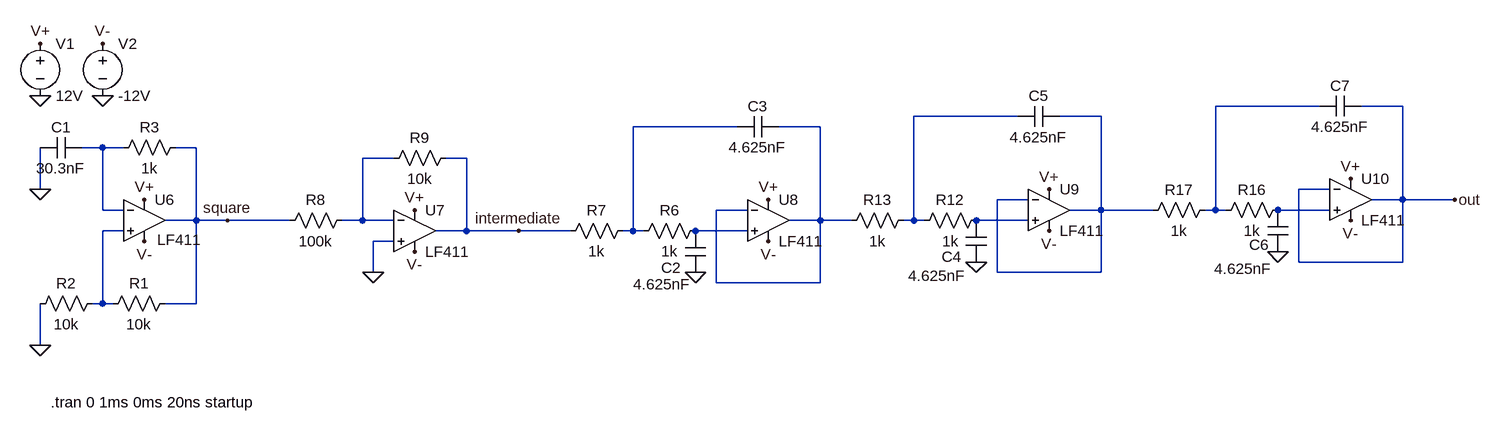
[diagram p0: schematic oscillator.asc]
oscillator.asc, the LTspice schematic file:
Version 4
SHEET 1 1064 680
WIRE 368 -448 208 -448
WIRE 496 -448 432 -448
WIRE -96 -432 -256 -432
WIRE 32 -432 -32 -432
WIRE -528 -416 -688 -416
WIRE -400 -416 -464 -416
WIRE -1504 -384 -1536 -384
WIRE -1472 -384 -1504 -384
WIRE -1360 -384 -1392 -384
WIRE -1056 -368 -1104 -368
WIRE -944 -368 -976 -368
WIRE -1600 -320 -1600 -384
WIRE 384 -320 336 -320
WIRE -80 -304 -128 -304
WIRE 496 -304 496 -448
WIRE 496 -304 448 -304
WIRE 576 -304 496 -304
WIRE -1504 -288 -1504 -384
WIRE -1472 -288 -1504 -288
WIRE -512 -288 -560 -288
WIRE 32 -288 32 -432
WIRE 32 -288 -16 -288
WIRE 112 -288 32 -288
WIRE 208 -288 208 -448
WIRE 208 -288 192 -288
WIRE 224 -288 208 -288
WIRE 384 -288 304 -288
WIRE -1360 -272 -1360 -384
WIRE -1360 -272 -1408 -272
WIRE -1312 -272 -1360 -272
WIRE -1216 -272 -1312 -272
WIRE -1104 -272 -1104 -368
WIRE -1104 -272 -1136 -272
WIRE -1056 -272 -1104 -272
WIRE -400 -272 -400 -416
WIRE -400 -272 -448 -272
WIRE -352 -272 -400 -272
WIRE -256 -272 -256 -432
WIRE -256 -272 -272 -272
WIRE -240 -272 -256 -272
WIRE -80 -272 -160 -272
WIRE -1472 -256 -1504 -256
WIRE -944 -256 -944 -368
WIRE -944 -256 -992 -256
WIRE -864 -256 -944 -256
WIRE -784 -256 -864 -256
WIRE -688 -256 -688 -416
WIRE -688 -256 -704 -256
WIRE -672 -256 -688 -256
WIRE -512 -256 -592 -256
WIRE -1056 -240 -1088 -240
WIRE 336 -208 336 -320
WIRE 496 -208 496 -304
WIRE 496 -208 336 -208
WIRE -1088 -192 -1088 -240
WIRE -128 -192 -128 -304
WIRE 32 -192 32 -288
WIRE 32 -192 -128 -192
WIRE -560 -176 -560 -288
WIRE -400 -176 -400 -272
WIRE -400 -176 -560 -176
WIRE -1504 -144 -1504 -256
WIRE -1504 -144 -1520 -144
WIRE -1488 -144 -1504 -144
WIRE -1360 -144 -1360 -272
WIRE -1360 -144 -1408 -144
WIRE -1600 -80 -1600 -144
FLAG -1600 -464 0
FLAG -1504 -464 0
FLAG -1600 -544 V+
FLAG -1504 -544 V-
FLAG -1440 -304 V+
FLAG -1440 -240 V-
FLAG -1600 -320 0
FLAG -1600 -80 0
FLAG -1312 -272 square
FLAG -480 -304 V+
FLAG -480 -240 V-
FLAG -592 -192 0
FLAG -1024 -288 V+
FLAG -1024 -224 V-
FLAG -1088 -192 0
FLAG -864 -256 intermediate
FLAG -48 -320 V+
FLAG -48 -256 V-
FLAG -160 -208 0
FLAG 416 -336 V+
FLAG 416 -272 V-
FLAG 304 -224 0
FLAG 576 -304 out
SYMBOL voltage -1600 -560 R0
WINDOW 123 0 0 Left 0
WINDOW 39 0 0 Left 0
SYMATTR InstName V1
SYMATTR Value 12V
SYMBOL voltage -1504 -560 R0
WINDOW 123 0 0 Left 0
WINDOW 39 0 0 Left 0
SYMATTR InstName V2
SYMATTR Value -12V
SYMBOL res -1392 -160 R90
WINDOW 0 0 56 VBottom 0
WINDOW 3 32 56 VTop 0
SYMATTR InstName R1
SYMATTR Value 10k
SYMBOL res -1504 -160 R90
WINDOW 0 0 56 VBottom 0
WINDOW 3 32 56 VTop 0
SYMATTR InstName R2
SYMATTR Value 10k
SYMBOL res -1376 -400 R90
WINDOW 0 0 56 VBottom 0
WINDOW 3 32 56 VTop 0
SYMATTR InstName R3
SYMATTR Value 1k
SYMBOL cap -1536 -400 R90
WINDOW 0 0 32 VBottom 0
WINDOW 3 32 32 VTop 0
SYMATTR InstName C1
SYMATTR Value 30.3nF
SYMBOL cap -608 -256 R0
WINDOW 0 -37 57 Left 0
WINDOW 3 -80 82 Left 0
SYMATTR InstName C2
SYMATTR Value 4.625nF
SYMBOL res -576 -272 R90
WINDOW 0 0 56 VBottom 0
WINDOW 3 32 56 VTop 0
SYMATTR InstName R6
SYMATTR Value 1k
SYMBOL res -688 -272 R90
WINDOW 0 0 56 VBottom 0
WINDOW 3 32 56 VTop 0
SYMATTR InstName R7
SYMATTR Value 1k
SYMBOL cap -464 -432 R90
WINDOW 0 0 32 VBottom 0
WINDOW 3 32 32 VTop 0
SYMATTR InstName C3
SYMATTR Value 4.625nF
SYMBOL res -1120 -288 R90
WINDOW 0 0 56 VBottom 0
WINDOW 3 32 56 VTop 0
SYMATTR InstName R8
SYMATTR Value 100k
SYMBOL res -960 -384 R90
WINDOW 0 0 56 VBottom 0
WINDOW 3 32 56 VTop 0
SYMATTR InstName R9
SYMATTR Value 10k
SYMBOL cap -176 -272 R0
WINDOW 0 -37 56 Left 0
WINDOW 3 -89 85 Left 0
SYMATTR InstName C4
SYMATTR Value 4.625nF
SYMBOL res -144 -288 R90
WINDOW 0 0 56 VBottom 0
WINDOW 3 32 56 VTop 0
SYMATTR InstName R12
SYMATTR Value 1k
SYMBOL res -256 -288 R90
WINDOW 0 0 56 VBottom 0
WINDOW 3 32 56 VTop 0
SYMATTR InstName R13
SYMATTR Value 1k
SYMBOL cap -32 -448 R90
WINDOW 0 0 32 VBottom 0
WINDOW 3 32 32 VTop 0
SYMATTR InstName C5
SYMATTR Value 4.625nF
SYMBOL cap 288 -288 R0
WINDOW 0 -28 53 Left 0
WINDOW 3 -82 90 Left 0
SYMATTR InstName C6
SYMATTR Value 4.625nF
SYMBOL res 320 -304 R90
WINDOW 0 0 56 VBottom 0
WINDOW 3 32 56 VTop 0
SYMATTR InstName R16
SYMATTR Value 1k
SYMBOL res 208 -304 R90
WINDOW 0 0 56 VBottom 0
WINDOW 3 32 56 VTop 0
SYMATTR InstName R17
SYMATTR Value 1k
SYMBOL cap 432 -464 R90
WINDOW 0 0 32 VBottom 0
WINDOW 3 32 32 VTop 0
SYMATTR InstName C7
SYMATTR Value 4.625nF
SYMBOL nat\\LF411 -1440 -336 R0
WINDOW 3 20 94 Left 0
SYMATTR InstName U6
SYMBOL nat\\LF411 -1024 -320 R0
SYMATTR InstName U7
SYMBOL nat\\LF411 -480 -336 R0
SYMATTR InstName U8
SYMBOL nat\\LF411 -48 -352 R0
SYMATTR InstName U9
SYMBOL nat\\LF411 416 -368 R0
SYMATTR InstName U10
TEXT -1584 8 Left 0 !.tran 0 1ms 0ms 20ns startup

The netlist it stands for:
* oscillator.asc
V1 V+ 0 12V
V2 V- 0 -12V
R1 square N010 10k
R2 N010 0 10k
R3 square N006 1k
C1 N006 0 30.3nF
C2 N011 0 4.625nF
R6 N011 N004 1k
R7 N004 intermediate 1k
C3 N005 N004 4.625nF
R8 N007 square 100k
R9 intermediate N007 10k
C4 N009 0 4.625nF
R12 N009 N002 1k
R13 N002 N005 1k
C5 N003 N002 4.625nF
C6 N008 0 4.625nF
R16 N008 N001 1k
R17 N001 N003 1k
C7 out N001 4.625nF
* U6: LF411 (symbol nat\LF411 not available, pins judged from their places): In+=N010 In-=N006 V+=V+ V-=V- OUT=square
* U7: LF411 (symbol nat\LF411 not available, pins judged from their places): In+=0 In-=N007 V+=V+ V-=V- OUT=intermediate
* U8: LF411 (symbol nat\LF411 not available, pins judged from their places): In+=N011 In-=N005 V+=V+ V-=V- OUT=N005
* U9: LF411 (symbol nat\LF411 not available, pins judged from their places): In+=N009 In-=N003 V+=V+ V-=V- OUT=N003
* U10: LF411 (symbol nat\LF411 not available, pins judged from their places): In+=N008 In-=out V+=V+ V-=V- OUT=out
.tran 0 1ms 0ms 20ns startup
.backanno
.end